# EAGLE schematic DigBMPproto (EAGLE 7.1.0)
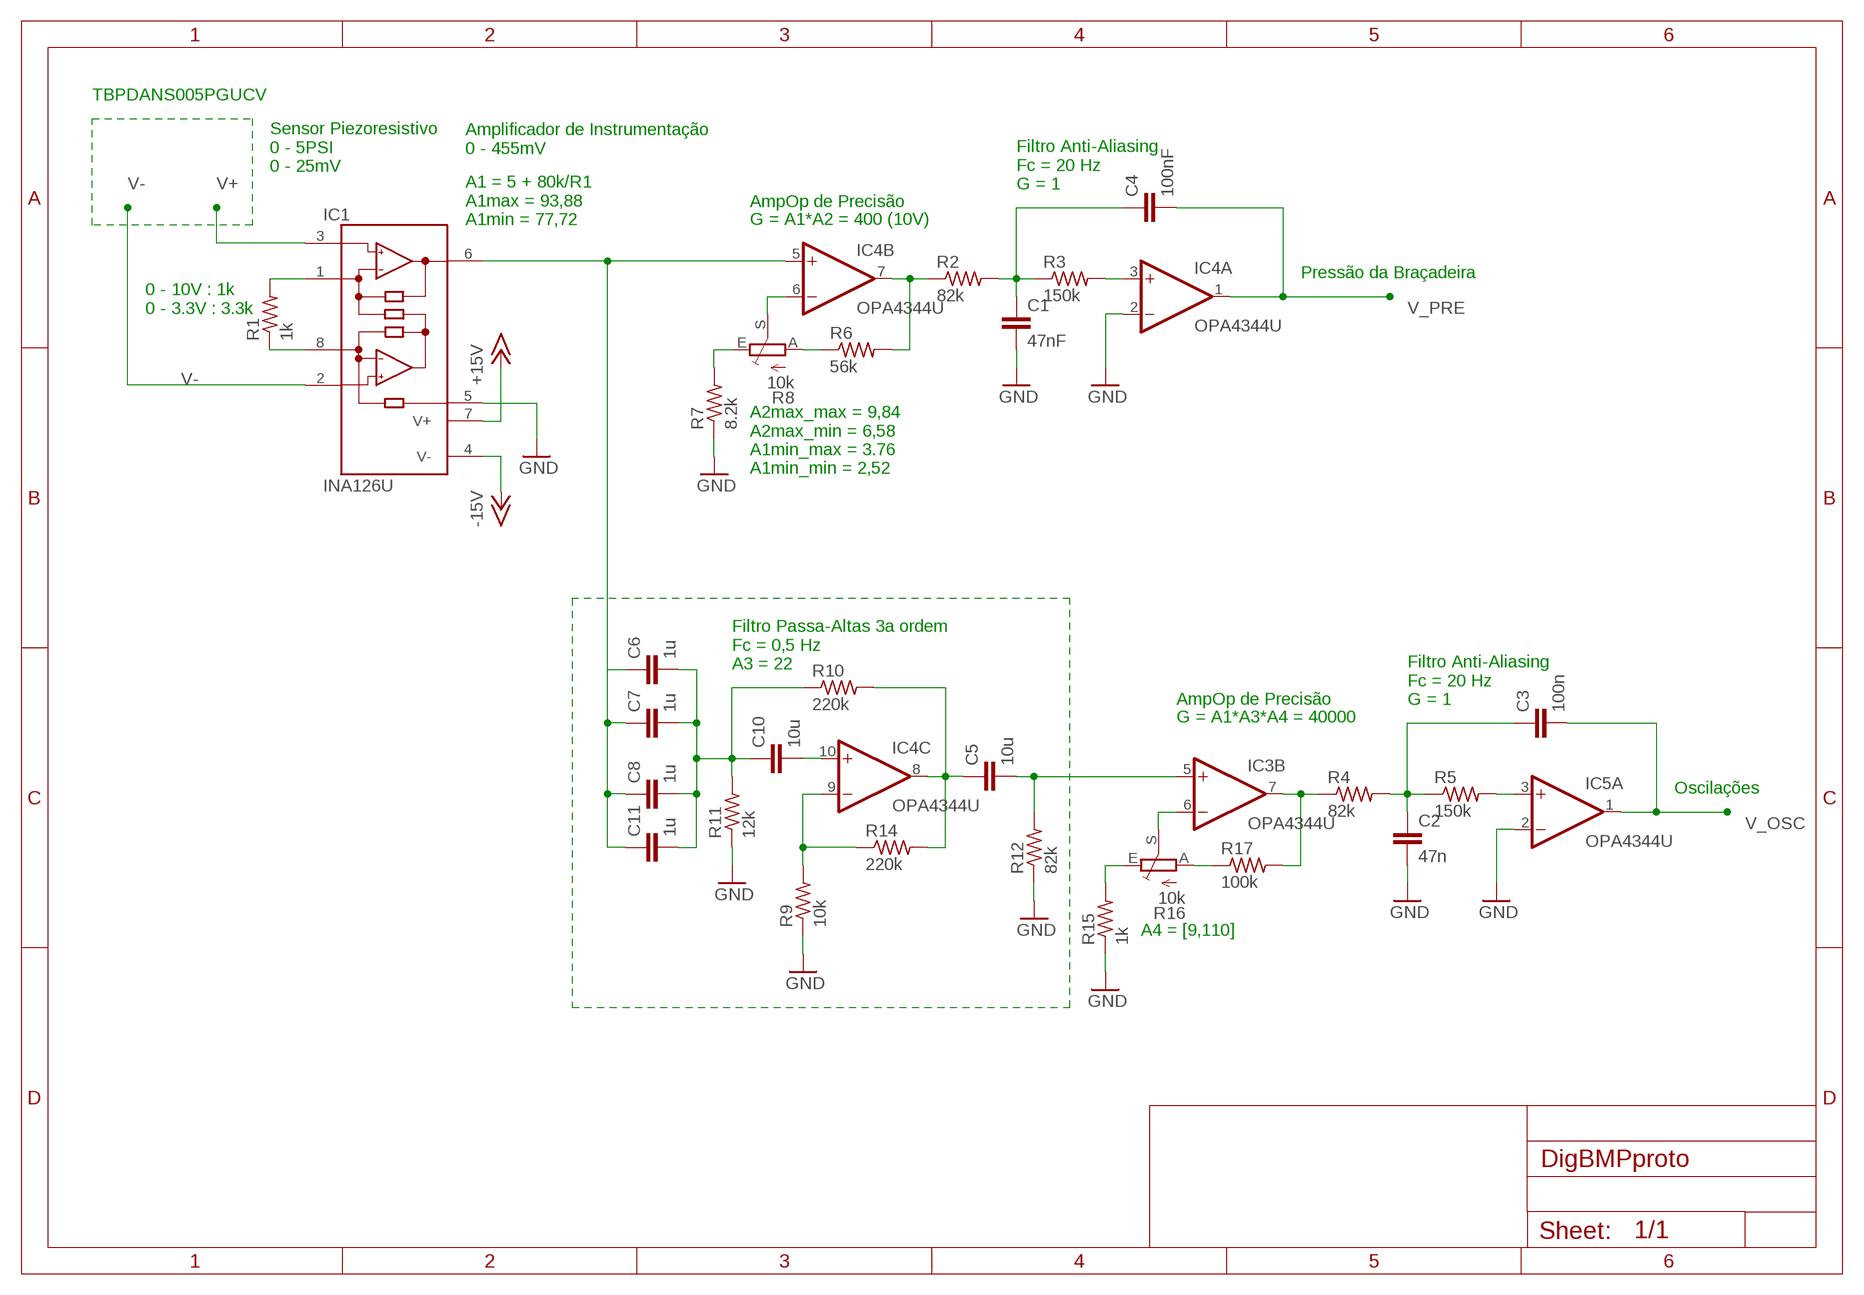
[diagram p0: schematic, sheet 1]

## Parts
C1  47nF  C-EUC3216  [C3216]
C2  47n  C-EUC3216  [C3216]
C3  100n  C-EUC3216  [C3216]
C4  100nF  C-EUC3216  [C3216]
C5  10u  C-EUC3216  [C3216]
C6  1u  C-EUC3216  [C3216]
C7  1u  C-EUC3216  [C3216]
C8  1u  C-EUC3216  [C3216]
C10  10u  C-EUC3216  [C3216]
C11  1u  C-EUC3216  [C3216]
IC1  INA126U  [SO08]
IC3  OPA4344U  [SO14]
IC4  OPA4344U  [SO14]
IC5  OPA4344U  [SO14]
R1  1k  R-US_M1206  [M1206]
R2  82k  R-US_M1206  [M1206]
R3  150k  R-US_M1206  [M1206]
R4  82k  R-US_M1206  [M1206]
R5  150k  R-US_M1206  [M1206]
R6  56k  R-US_M1206  [M1206]
R7  8.2k  R-US_M1206  [M1206]
R8  10k  TRIM_EU-B64Y  [B64Y]
R9  10k  R-US_M1206  [M1206]
R10  220k  R-US_M1206  [M1206]
R11  12k  R-US_M1206  [M1206]
R12  82k  R-US_M1206  [M1206]
R14  220k  R-US_M1206  [M1206]
R15  1k  R-US_M1206  [M1206]
R16  10k  TRIM_EU-B64Y  [B64Y]
R17  100k  R-US_M1206  [M1206]

## Nets
GND: C1.2 C2.2 IC1.5(REF) IC4.2(A:-IN) IC5.2(A:-IN) R7.1 R9.1 R11.1 R12.1 R15.1
N$2: IC4.7(B:OUT) R2.1 R6.2
N$3: IC1.1(RG) R1.2
N$4: IC1.8(RG) R1.1
N$5: IC4.3(A:+IN) R3.2
N$6: C1.1 C4.1 R2.2 R3.1
N$7: C5.2 IC3.5(B:+IN) R12.2
N$8: IC3.7(B:OUT) R4.1 R17.2
N$9: C10.2 IC4.10(C:+IN)
N$10: C2.1 C3.1 R4.2 R5.1
N$11: R7.2 R8.E
N$12: IC4.6(B:-IN) R8.S
N$13: C3.2 IC5.1(A:OUT)
N$14: R6.1 R8.A
N$16: IC4.9(C:-IN) R9.2 R14.1
N$17: C6.2 C7.2 C8.2 C10.1 C11.2 R10.1 R11.2
N$18: C5.1 IC4.8(C:OUT) R10.2 R14.2
N$19: R15.2 R16.E
N$20: IC5.3(A:+IN) R5.2
N$21: IC3.6(B:-IN) R16.S
N$22: R16.A R17.1
V1: C6.1 C7.1 C8.1 C11.1 IC1.6(OUT) IC4.5(B:+IN)
V+: IC1.3(+IN)
V-: IC1.2(-IN)
V_PRE: C4.2 IC4.1(A:OUT)
Unconnected: IC3.1(A:OUT) IC3.2(A:-IN) IC3.3(A:+IN) IC3.8(C:OUT) IC3.9(C:-IN) IC3.10(C:+IN) IC3.12(D:+IN) IC3.13(D:-IN) IC3.14(D:OUT) IC4.12(D:+IN) IC4.13(D:-IN) IC4.14(D:OUT) IC5.5(B:+IN) IC5.6(B:-IN) IC5.7(B:OUT) IC5.8(C:OUT) IC5.9(C:-IN) IC5.10(C:+IN) IC5.12(D:+IN) IC5.13(D:-IN) IC5.14(D:OUT)

## Notes on the sheet
- TBPDANS005PGUCV
- Amplificador de Instrumentação
  0 - 455mV
- Sensor Piezoresistivo
  0 - 5PSI
  0 - 25mV
- Filtro Anti-Aliasing
  Fc = 20 Hz
  G = 1
- AmpOp de Precisão
- A1 = 5 + 80k/R1
  A1max = 93,88
  A1min = 77,72
- G = A1*A2 = 400 (10V)
- Pressão da Braçadeira
- 0 - 10V : 1k
  0 - 3.3V : 3.3k
- A2max_max = 9,84
  A2max_min = 6,58
  A1min_max = 3.76
  A1min_min = 2,52
- Filtro Passa-Altas 3a ordem
  Fc = 0,5 Hz
  A3 = 22
- AmpOp de Precisão
- Filtro Anti-Aliasing
  Fc = 20 Hz
  G = 1
- G = A1*A3*A4 = 40000
- Oscilações
- A4 = [9,110]

## Power pins joined to a net without a drawn wire
V+: IC1.7(V+) IC3.4(P:V+) IC4.4(P:V+) IC5.4(P:V+)
V-: IC1.4(V-) IC3.11(P:V-) IC4.11(P:V-) IC5.11(P:V-)

## Library data of the parts
C1-C8 C10 C11 = rcl:C-EU: CAPACITOR, European symbol
IC1 = burr-brown:INA126: Instrumentation Amplifier Micropower, Single and Dual Versions; MF: TEXAS INSTRUMENTS; MPN: INA126U; OC_FARNELL: 1212409; OC_NEWARK: 84K8003
IC3-IC5 = linear:OPA4*: Quad Operational Amplifier compatible with: TLC27L4 Low Power, Single-Supply, Rail-To-Rail Operational Amplifier Source: http://focus.ti.com/lit/ds/symlink/opa2345.pdf http://focus.ti.com .. opa241.pdf http://focus.ti.com .. tlc27l4.pdf http://focus.ti.com/lit/ds/symlink/opa2134.pdf
R1-R7 R9-R12 R14 R15 R17 = resistor:R-US_: RESISTOR, American symbol
R8 R16 = pot:TRIM_EU-: POTENTIOMETER